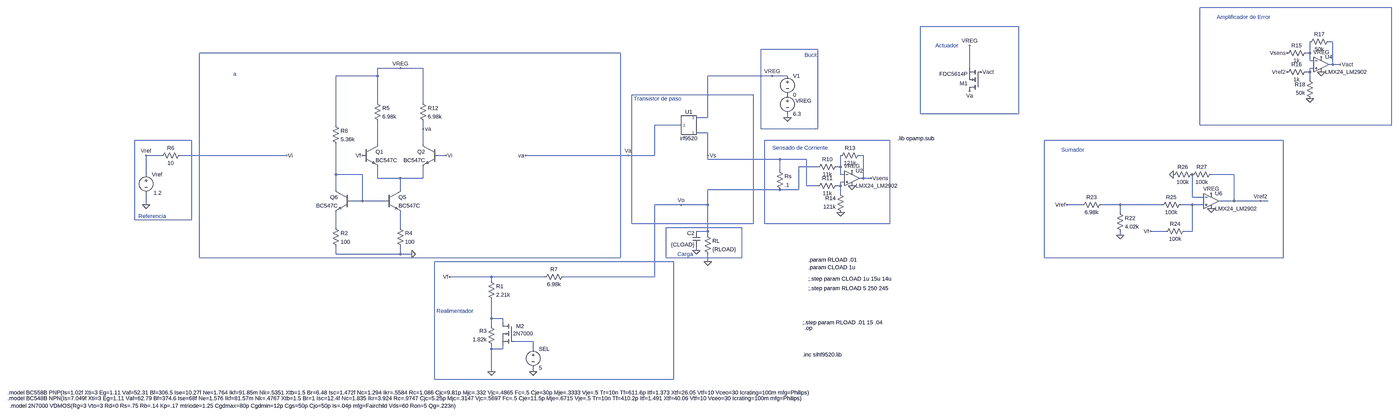
[diagram p0: schematic LDO_LM324.asc, whole sheet]
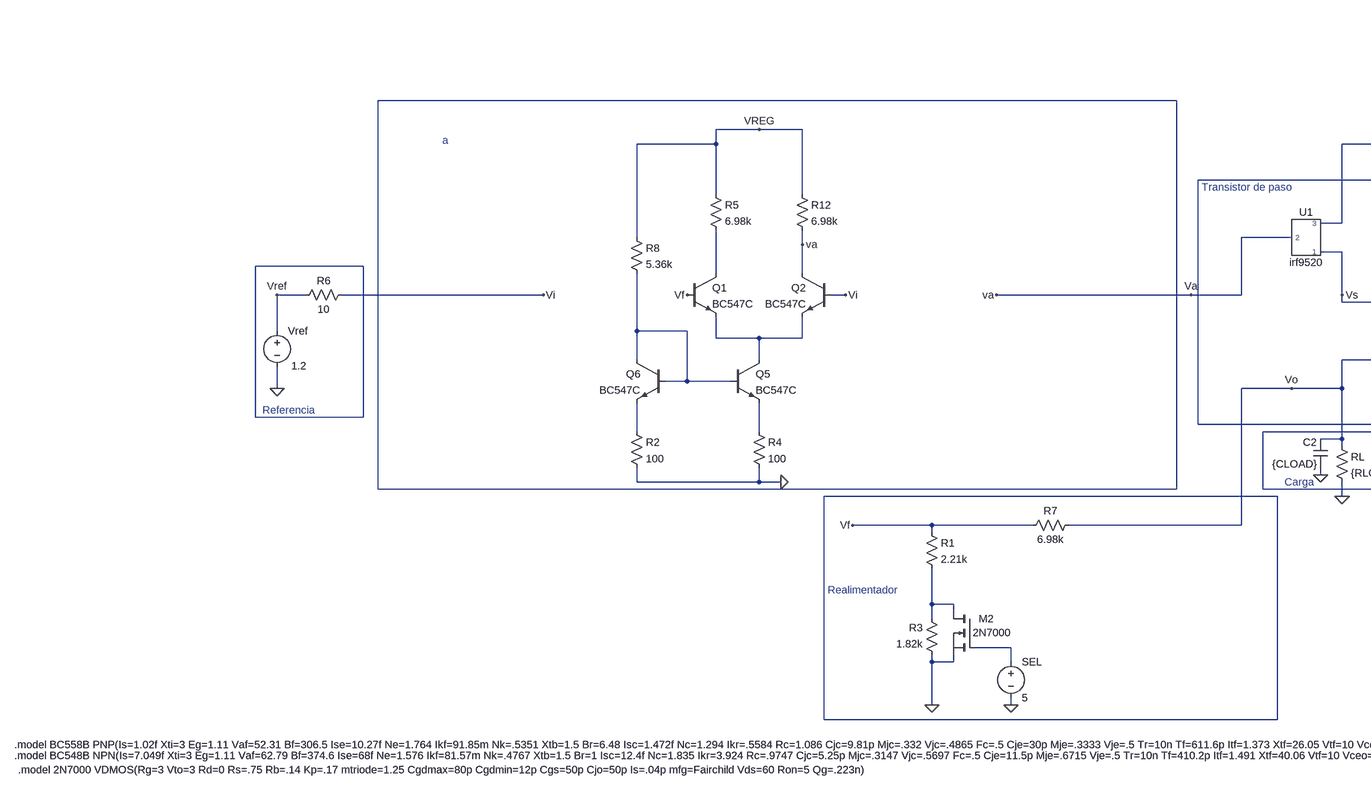
[diagram p1: schematic LDO_LM324.asc, part, row 1 of 1, column 1 of 2]
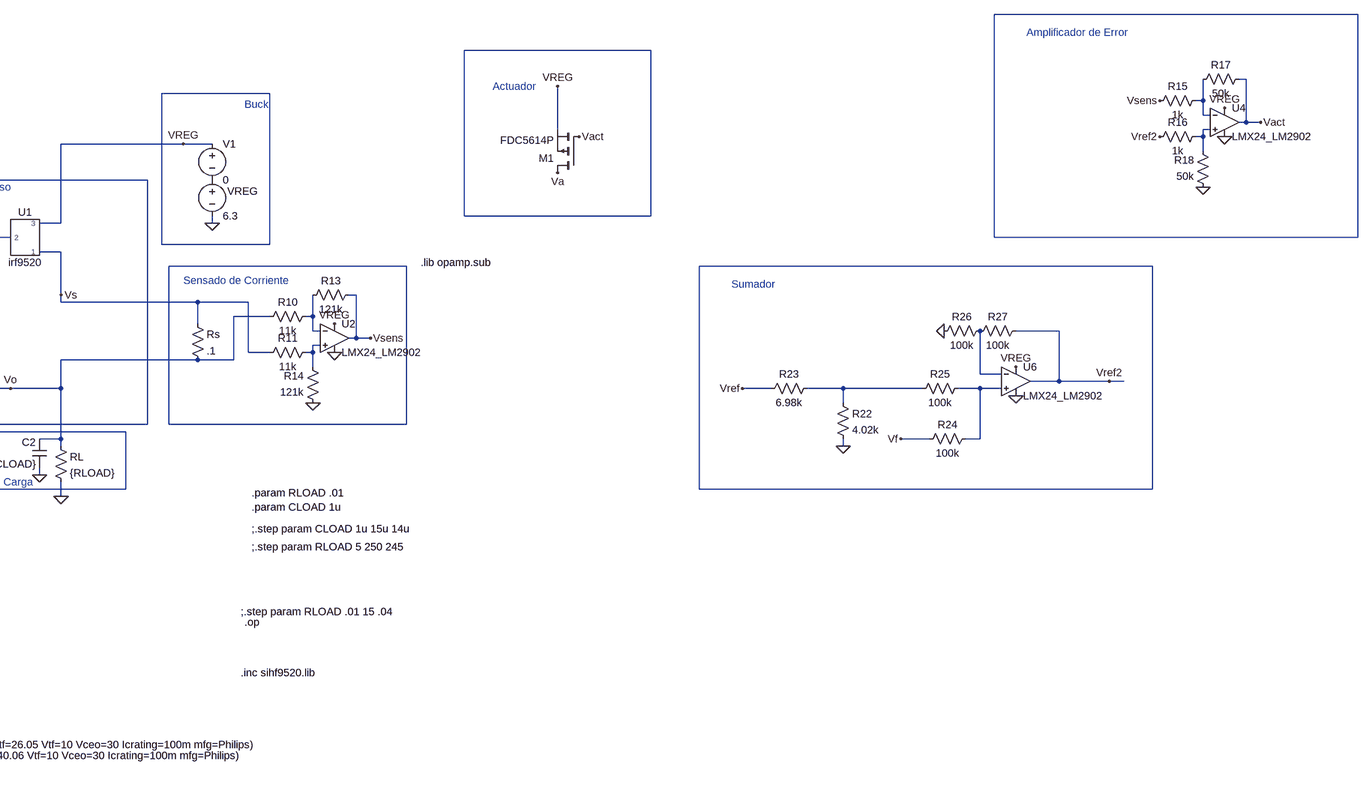
[diagram p2: schematic LDO_LM324.asc, part, row 1 of 1, column 2 of 2]
LDO_LM324.asc, the LTspice schematic file:
Version 4
SHEET 1 26844 1296
WIRE 4848 -512 3840 -512
WIRE 2992 -432 2528 -432
WIRE 4400 -368 4384 -368
WIRE 2096 -336 1856 -336
WIRE 1264 -320 -512 -320
WIRE 4304 -320 4304 -368
WIRE 4304 -320 4288 -320
WIRE 4304 -288 4304 -320
WIRE 4320 -288 4304 -288
WIRE 4400 -272 4400 -368
WIRE 4400 -272 4384 -272
WIRE 4432 -272 4400 -272
WIRE 336 -256 240 -256
WIRE 432 -256 336 -256
WIRE 2736 -256 2736 -352
WIRE 4320 -256 4304 -256
WIRE 4304 -240 4304 -256
WIRE 4304 -240 4288 -240
WIRE 240 -224 240 -256
WIRE 240 -224 64 -224
WIRE 1904 -224 1632 -224
WIRE 1968 -224 1904 -224
WIRE 4304 -208 4304 -240
WIRE 1824 -144 1312 -144
WIRE 240 -112 240 -224
WIRE 432 -112 432 -256
WIRE 2528 -64 2528 -432
WIRE 2992 -64 2992 -432
WIRE 2992 -64 2528 -64
WIRE 1632 -48 1632 -224
WIRE 1632 -48 1584 -48
WIRE 1968 -48 1968 -64
WIRE 64 -16 64 -224
WIRE 1520 -16 1408 -16
WIRE 3840 -16 3840 -512
WIRE 4848 -16 4848 -512
WIRE 4848 -16 3840 -16
WIRE 432 0 432 -32
WIRE 1856 0 1856 -336
WIRE 2096 0 2096 -336
WIRE 2096 0 1856 0
WIRE 1632 16 1584 16
WIRE -544 48 -784 48
WIRE 2400 48 1872 48
WIRE 4192 48 3184 48
WIRE 240 64 240 -32
WIRE 432 64 432 0
WIRE -672 112 -736 112
WIRE -144 112 -592 112
WIRE 528 112 496 112
WIRE 1296 112 864 112
WIRE 1408 112 1408 -16
WIRE 1408 112 1296 112
WIRE 1632 112 1632 16
WIRE 2288 112 2272 112
WIRE 1632 128 1632 112
WIRE 1936 128 1632 128
WIRE 2048 128 1936 128
WIRE 2096 160 2016 160
WIRE 2192 160 2192 112
WIRE 2192 160 2176 160
WIRE 1936 176 1936 128
WIRE -736 192 -736 112
WIRE 64 192 64 64
WIRE 176 192 64 192
WIRE 2192 192 2192 160
WIRE 2208 192 2192 192
WIRE 3984 192 3888 192
WIRE 240 208 240 160
WIRE 336 208 240 208
WIRE 432 208 432 160
WIRE 432 208 336 208
WIRE 2288 208 2288 112
WIRE 2288 208 2272 208
WIRE 2320 208 2288 208
WIRE 2208 224 2192 224
WIRE 2048 240 2048 128
WIRE 2096 240 2048 240
WIRE 2192 240 2192 224
WIRE 2192 240 2176 240
WIRE 64 256 64 192
WIRE 336 256 336 208
WIRE 1936 256 1632 256
WIRE 2016 256 2016 160
WIRE 2016 256 1936 256
WIRE 2192 272 2192 240
WIRE 3808 288 3808 192
WIRE 3856 288 3808 288
WIRE 176 304 176 192
WIRE 176 304 128 304
WIRE 272 304 176 304
WIRE 3984 304 3984 192
WIRE 3984 304 3920 304
WIRE 4096 304 3984 304
WIRE 4128 304 4096 304
WIRE -736 320 -736 272
WIRE 1520 320 1408 320
WIRE 1632 320 1632 256
WIRE 1632 320 1520 320
WIRE 3344 320 3280 320
WIRE 3504 320 3424 320
WIRE 3680 320 3504 320
WIRE 3808 320 3760 320
WIRE 3856 320 3808 320
WIRE 3504 352 3504 320
WIRE -784 384 -784 48
WIRE -544 384 -544 48
WIRE -544 384 -784 384
WIRE 1312 400 1312 -144
WIRE 1824 400 1824 -144
WIRE 1824 400 1312 400
WIRE 1872 400 1872 48
WIRE 2400 400 2400 48
WIRE 2400 400 1872 400
WIRE 64 416 64 352
WIRE 336 416 336 352
WIRE 1776 416 1456 416
WIRE 1632 432 1632 320
WIRE 1632 432 1584 432
WIRE 3696 432 3632 432
WIRE 3808 432 3808 320
WIRE 3808 432 3776 432
WIRE 1632 448 1632 432
WIRE 3504 448 3504 432
WIRE 1584 512 1584 496
WIRE 64 528 64 496
WIRE 336 528 336 496
WIRE 336 528 64 528
WIRE 384 528 336 528
WIRE -512 544 -512 -320
WIRE 1264 544 1264 -320
WIRE 1264 544 -512 544
WIRE 1456 544 1456 416
WIRE 1776 544 1776 416
WIRE 1776 544 1456 544
WIRE 3184 544 3184 48
WIRE 4192 544 4192 48
WIRE 4192 544 3184 544
WIRE 1488 560 480 560
WIRE 1632 560 1632 528
WIRE 720 624 544 624
WIRE 944 624 720 624
WIRE 1408 624 1408 320
WIRE 1408 624 1024 624
WIRE 720 640 720 624
WIRE 720 800 720 720
WIRE 768 800 720 800
WIRE 768 816 768 800
WIRE 720 832 720 800
WIRE 896 896 816 896
WIRE 720 928 720 912
WIRE 768 928 768 912
WIRE 768 928 720 928
WIRE 896 928 896 896
WIRE 720 1024 720 928
WIRE 896 1024 896 1008
WIRE 480 1056 480 560
WIRE 1488 1056 1488 560
WIRE 1488 1056 480 1056
FLAG 1632 560 0
FLAG -736 320 0
FLAG 1296 112 Va
FLAG -736 112 Vref
FLAG 720 1024 0
FLAG 1520 320 Vo
FLAG 1968 -48 0
FLAG 1584 512 0
FLAG 384 528 0
FLAG 544 624 Vf
FLAG 336 -256 VREG
FLAG -144 112 Vi
FLAG 432 0 va
FLAG 864 112 va
FLAG 528 112 Vi
FLAG 176 112 Vf
FLAG 1904 -224 VREG
FLAG 896 1024 0
FLAG 1632 112 Vs
FLAG 2736 -352 VREG
FLAG 2784 -240 Vact
FLAG 2736 -160 Va
FLAG 2320 208 Vsens
FLAG 2192 352 0
FLAG 3504 448 0
FLAG 4096 304 Vref2
FLAG 3280 320 Vref
FLAG 3632 432 Vf
FLAG 3728 192 0
FLAG 4304 -128 0
FLAG 4432 -272 Vact
FLAG 4208 -240 Vref2
FLAG 4208 -320 Vsens
FLAG 4352 -240 0
FLAG 4352 -304 VREG
FLAG 2240 240 0
FLAG 2240 176 VREG
FLAG 3888 336 0
FLAG 3888 272 VREG
SYMBOL voltage -736 176 R0
WINDOW 123 0 0 Left 0
WINDOW 39 0 0 Left 0
WINDOW 3 66 94 Right 2
SYMATTR Value 1.2
SYMATTR InstName Vref
SYMBOL res 1616 432 R0
SYMATTR InstName RL
SYMATTR Value {RLOAD}
SYMBOL res 704 624 R0
SYMATTR InstName R1
SYMATTR Value 2.21k
SYMBOL res 736 928 R180
WINDOW 0 36 76 Left 2
WINDOW 3 36 40 Left 2
SYMATTR InstName R3
SYMATTR Value 1.82k
SYMBOL voltage 1968 -160 R0
WINDOW 123 0 0 Left 0
WINDOW 39 0 0 Left 0
WINDOW 0 34 41 Left 2
SYMATTR InstName VREG
SYMATTR Value 6.3
SYMBOL voltage 1968 -240 R0
WINDOW 123 0 0 Left 0
WINDOW 39 0 0 Left 0
SYMATTR InstName V1
SYMATTR Value 0
SYMBOL npn 176 64 R0
SYMATTR InstName Q1
SYMATTR Value BC547C
SYMBOL npn 496 64 M0
SYMATTR InstName Q2
SYMATTR Value BC547C
SYMBOL res 224 -128 R0
SYMATTR InstName R5
SYMATTR Value 6.98k
SYMBOL res -576 96 R90
WINDOW 0 0 56 VBottom 2
WINDOW 3 32 56 VTop 2
SYMATTR InstName R6
SYMATTR Value 10
SYMBOL res 1040 608 R90
WINDOW 0 0 56 VBottom 2
WINDOW 3 32 56 VTop 2
SYMATTR InstName R7
SYMATTR Value 6.98k
SYMBOL voltage 896 912 R0
WINDOW 123 0 0 Left 0
WINDOW 39 0 0 Left 0
SYMATTR InstName SEL
SYMATTR Value 5
SYMBOL npn 272 256 R0
SYMATTR InstName Q5
SYMATTR Value BC547C
SYMBOL npn 128 256 M0
SYMATTR InstName Q6
SYMATTR Value BC547C
SYMBOL res 48 -32 R0
SYMATTR InstName R8
SYMATTR Value 5.36k
SYMBOL res 48 400 R0
SYMATTR InstName R2
SYMATTR Value 100
SYMBOL res 320 400 R0
SYMATTR InstName R4
SYMATTR Value 100
SYMBOL res 1920 160 R0
SYMATTR InstName Rs
SYMATTR Value .1
SYMBOL res 416 -128 R0
SYMATTR InstName R12
SYMATTR Value 6.98k
SYMBOL nmos 816 816 M0
WINDOW 0 -42 16 Left 2
WINDOW 3 -80 47 Left 2
SYMATTR InstName M2
SYMATTR Value 2N7000
SYMBOL AutoGenerated\\irf9520 1552 -16 R0
SYMATTR InstName U1
SYMBOL pmos 2784 -160 R180
SYMATTR InstName M1
SYMATTR Value FDC5614P
SYMBOL res 2192 144 R90
WINDOW 0 0 56 VBottom 2
WINDOW 3 32 56 VTop 2
SYMATTR InstName R10
SYMATTR Value 11k
SYMBOL res 2192 224 R90
WINDOW 0 0 56 VBottom 2
WINDOW 3 32 56 VTop 2
SYMATTR InstName R11
SYMATTR Value 11k
SYMBOL res 2288 96 R90
WINDOW 0 0 56 VBottom 2
WINDOW 3 32 56 VTop 2
SYMATTR InstName R13
SYMATTR Value 121k
SYMBOL res 2208 368 R180
WINDOW 0 36 76 Left 2
WINDOW 3 36 40 Left 2
SYMATTR InstName R14
SYMATTR Value 121k
SYMBOL res 3488 336 R0
SYMATTR InstName R22
SYMATTR Value 4.02k
SYMBOL res 3440 304 R90
WINDOW 0 0 56 VBottom 2
WINDOW 3 32 56 VTop 2
SYMATTR InstName R23
SYMATTR Value 6.98k
SYMBOL res 3792 416 R90
WINDOW 0 0 56 VBottom 2
WINDOW 3 32 56 VTop 2
SYMATTR InstName R24
SYMATTR Value 100k
SYMBOL res 3776 304 R90
WINDOW 0 0 56 VBottom 2
WINDOW 3 32 56 VTop 2
SYMATTR InstName R25
SYMATTR Value 100k
SYMBOL res 3824 176 R90
WINDOW 0 0 56 VBottom 2
WINDOW 3 32 56 VTop 2
SYMATTR InstName R26
SYMATTR Value 100k
SYMBOL res 3904 176 R90
WINDOW 0 0 56 VBottom 2
WINDOW 3 32 56 VTop 2
SYMATTR InstName R27
SYMATTR Value 100k
SYMBOL res 4304 -336 R90
WINDOW 0 0 56 VBottom 2
WINDOW 3 32 56 VTop 2
SYMATTR InstName R15
SYMATTR Value 1k
SYMBOL res 4304 -256 R90
WINDOW 0 0 56 VBottom 2
WINDOW 3 32 56 VTop 2
SYMATTR InstName R16
SYMATTR Value 1k
SYMBOL res 4400 -384 R90
WINDOW 0 0 56 VBottom 2
WINDOW 3 32 56 VTop 2
SYMATTR InstName R17
SYMATTR Value 50k
SYMBOL res 4320 -112 R180
WINDOW 0 36 76 Left 2
WINDOW 3 36 40 Left 2
SYMATTR InstName R18
SYMATTR Value 50k
SYMBOL cap 1600 496 R180
WINDOW 0 24 56 Left 2
WINDOW 3 24 8 Left 2
SYMATTR InstName C2
SYMATTR Value {CLOAD}
SYMBOL AutoGenerated\\LMX24_LM2902 4352 -272 R0
SYMATTR InstName U4
SYMBOL AutoGenerated\\LMX24_LM2902 2240 208 R0
SYMATTR InstName U2
SYMBOL AutoGenerated\\LMX24_LM2902 3888 304 R0
SYMATTR InstName U6
TEXT -768 368 Left 2 ;Referencia
TEXT 488 768 Left 2 ;Realimentador
TEXT -368 -232 Left 2 ;a
TEXT 1320 -128 Left 2 ;Transistor de paso
TEXT 1504 528 Left 2 ;Carga
TEXT 2032 816 Left 2 !;.step param RLOAD .01 15 .04
TEXT -1320 1112 Left 2 !.model BC558B PNP(Is=1.02f Xti=3 Eg=1.11 Vaf=52.31 Bf=306.5 Ise=10.27f Ne=1.764 Ikf=91.85m Nk=.5351 Xtb=1.5 Br=6.48 Isc=1.472f Nc=1.294 Ikr=.5584 Rc=1.086 Cjc=9.81p Mjc=.332 Vjc=.4865 Fc=.5 Cje=30p Mje=.3333 Vje=.5 Tr=10n Tf=611.6p Itf=1.373 Xtf=26.05 Vtf=10 Vceo=30 Icrating=100m mfg=Philips)
TEXT -1320 1136 Left 2 !.model BC548B NPN(Is=7.049f Xti=3 Eg=1.11 Vaf=62.79 Bf=374.6 Ise=68f Ne=1.576 Ikf=81.57m Nk=.4767 Xtb=1.5 Br=1 Isc=12.4f Nc=1.835 Ikr=3.924 Rc=.9747 Cjc=5.25p Mjc=.3147 Vjc=.5697 Fc=.5 Cje=11.5p Mje=.6715 Vje=.5 Tr=10n Tf=410.2p Itf=1.491 Xtf=40.06 Vtf=10 Vceo=30 Icrating=100m mfg=Philips)
TEXT 2040 840 Left 2 !.op
TEXT 2040 -312 Left 2 ;Buck
TEXT 2032 952 Left 2 !.inc sihf9520.lib
TEXT -1312 1168 Left 2 !.model 2N7000 VDMOS(Rg=3 Vto=3 Rd=0 Rs=.75 Rb=.14 Kp=.17 mtriode=1.25 Cgdmax=80p Cgdmin=12p Cgs=50p Cjo=50p Is=.04p mfg=Fairchild Vds=60 Ron=5 Qg=.223n)
TEXT 2592 -352 Left 2 ;Actuador
TEXT 2432 40 Left 2 !.lib opamp.sub
TEXT 3256 88 Left 2 ;Sumador
TEXT 3912 -472 Left 2 ;Amplificador de Error
TEXT 1904 80 Left 2 ;Sensado de Corriente
TEXT 2056 672 Left 2 !;.step param RLOAD 5 250 245
TEXT 2056 632 Left 2 !;.step param CLOAD 1u 15u 14u
TEXT 2056 584 Left 2 !.param CLOAD 1u
TEXT 2056 552 Left 2 !.param RLOAD .01

The netlist it stands for:
* LDO_LM324.asc
Vref Vref 0 1.2
RL Vo 0 {RLOAD}
R1 Vf N023 2.21k
R3 0 N023 1.82k
VREG P001 0 6.3
V1 VREG P001 0
Q1 N011 Vf N014 0 BC547C
Q2 Va Vi N014 0 BC547C
R5 VREG N011 6.98k
R6 Vi Vref 10
R7 Vo Vf 6.98k
V§SEL N024 0 5
Q5 N014 N013 N020 0 BC547C
Q6 N013 N013 N019 0 BC547C
R8 VREG N013 5.36k
R2 N019 0 100
R4 N020 0 100
Rs Vs Vo .1
R12 VREG Va 6.98k
M2 N023 N024 0 0 2N7000
XU1 Vs Va VREG irf9520  ; pins 1 2 3
M1 Va Vact VREG VREG FDC5614P
R10 N012 Vo 11k
R11 N015 Vs 11k
R13 Vsens N012 121k
R14 0 N015 121k
R22 N017 0 4.02k
R23 N017 Vref 6.98k
R24 N018 Vf 100k
R25 N018 N017 100k
R26 N016 0 100k
R27 Vref2 N016 100k
R15 N005 Vsens 1k
R16 N006 Vref2 1k
R17 Vact N005 50k
R18 0 N006 50k
C2 0 Vo {CLOAD}
* U4: LMX24_LM2902 (symbol AutoGenerated\LMX24_LM2902 not available, pins judged from their places): In+=N006 In-=N005 V+=VREG V-=0 OUT=Vact
* U2: LMX24_LM2902 (symbol AutoGenerated\LMX24_LM2902 not available, pins judged from their places): In+=N015 In-=N012 V+=VREG V-=0 OUT=Vsens
* U6: LMX24_LM2902 (symbol AutoGenerated\LMX24_LM2902 not available, pins judged from their places): In+=N018 In-=N016 V+=VREG V-=0 OUT=Vref2
.model NPN NPN
.model PNP PNP
.lib standard.bjt
.model NMOS NMOS
.model PMOS PMOS
.lib standard.mos
* Referencia
* Realimentador
* a
* Transistor de paso
* Carga
;.step param RLOAD .01 15 .04
.model BC558B PNP(Is=1.02f Xti=3 Eg=1.11 Vaf=52.31 Bf=306.5 Ise=10.27f Ne=1.764 Ikf=91.85m Nk=.5351 Xtb=1.5 Br=6.48 Isc=1.472f Nc=1.294 Ikr=.5584 Rc=1.086 Cjc=9.81p Mjc=.332 Vjc=.4865 Fc=.5 Cje=30p Mje=.3333 Vje=.5 Tr=10n Tf=611.6p Itf=1.373 Xtf=26.05 Vtf=10 Vceo=30 Icrating=100m mfg=Philips)
.model BC548B NPN(Is=7.049f Xti=3 Eg=1.11 Vaf=62.79 Bf=374.6 Ise=68f Ne=1.576 Ikf=81.57m Nk=.4767 Xtb=1.5 Br=1 Isc=12.4f Nc=1.835 Ikr=3.924 Rc=.9747 Cjc=5.25p Mjc=.3147 Vjc=.5697 Fc=.5 Cje=11.5p Mje=.6715 Vje=.5 Tr=10n Tf=410.2p Itf=1.491 Xtf=40.06 Vtf=10 Vceo=30 Icrating=100m mfg=Philips)
.op
* Buck
.inc sihf9520.lib
.model 2N7000 VDMOS(Rg=3 Vto=3 Rd=0 Rs=.75 Rb=.14 Kp=.17 mtriode=1.25 Cgdmax=80p Cgdmin=12p Cgs=50p Cjo=50p Is=.04p mfg=Fairchild Vds=60 Ron=5 Qg=.223n)
* Actuador
.lib opamp.sub
* Sumador
* Amplificador de Error
* Sensado de Corriente
;.step param RLOAD 5 250 245
;.step param CLOAD 1u 15u 14u
.param CLOAD 1u
.param RLOAD .01
.lib sihf9520.txt
.backanno
.end